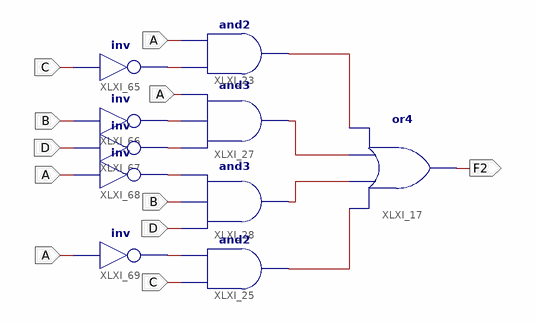
[diagram p0: schematic sheet 1]
// Xilinx ISE schematic p2simple.sch (spartan3e) as structural Verilog: 10 symbols, 5 ports
module p2simple (
  input  A,
  input  C,
  input  B,
  input  D,
  output F2
);

  wire XLXN_24, XLXN_25, XLXN_26, XLXN_27, XLXN_46, XLXN_47, XLXN_49, XLXN_50, XLXN_51;

  and XLXI_27 (XLXN_25, XLXN_49, XLXN_47, A);
  and XLXI_23 (XLXN_24, XLXN_46, A);
  and XLXI_28 (XLXN_26, D, B, XLXN_50);
  and XLXI_25 (XLXN_27, C, XLXN_51);
  not XLXI_65 (XLXN_46, C);
  not XLXI_66 (XLXN_47, B);
  not XLXI_67 (XLXN_49, D);
  not XLXI_68 (XLXN_50, A);
  not XLXI_69 (XLXN_51, A);
  or XLXI_17 (F2, XLXN_27, XLXN_26, XLXN_25, XLXN_24);
endmodule
